# EAGLE design Main board v2.0 (EAGLE 7.5.0)
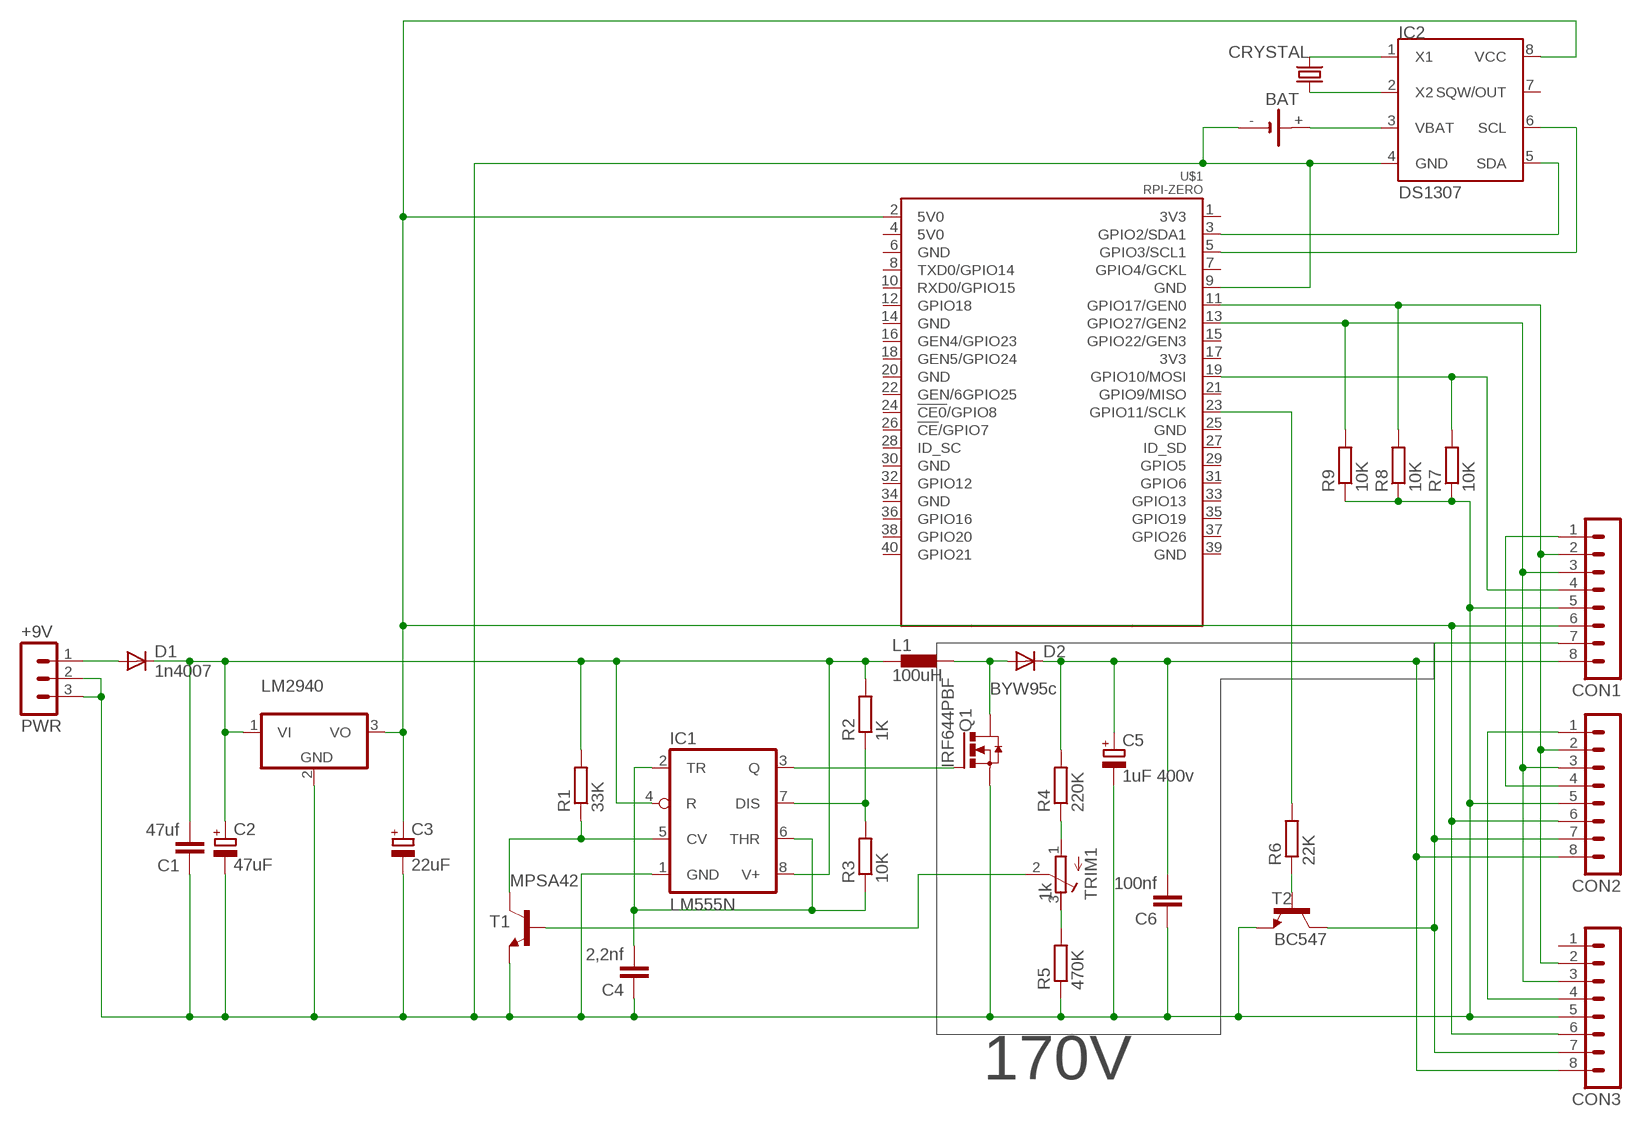
[diagram p0: schematic, sheet 1]

## Parts
BAT  CH291-1220LF  [CH291-1220LF]
C1  47uf  C-EU025-025X050  [C025-025X050]
C2  47uF  CPOL-EUE5-8.5  [E5-8,5]
C3  22uF  CPOL-EUE2.5-5V  [E2,5-4R]
C4  2,2nf  C5/2.5  [C5B2.5]
C5  1uF 400v  CPOL-EUE2.5-6  [E2,5-6]
C6  100nf  C-EU075-032X103  [C075-032X103]
CON1  MA08-1  [MA08-1]
CON2  MA08-1  [MA08-1]
CON3  MA08-1  [MA08-1]
CRYSTAL  crystal  CRYSTALTC26H  [TC26H]
D1  1n4007  DIODE-DO41-10  [DO41-10]
D2  BYW95c  BYW95  [SOD64-10]
IC1  LM555N  [DIL08]
IC2  DS1307  [SOIC-8]
L1  100uH  DR1030  [DR1030]
LM2940  7824T  7824TV  [TO220V]
PWR  +9V  MA03-1  [MA03-1]
Q1  IRF644PBF  IRF3704L  [TO262-H]
R1  33K  R-EU_0207/10  [0207/10]
R2  1K  R-EU_0207/10  [0207/10]
R3  10K  R-EU_0207/10  [0207/10]
R4  220K  R-EU_0207/10  [0207/10]
R5  470K  R-EU_0207/10  [0207/10]
R6  22K  R-EU_0207/10  [0207/10]
R7  10K  R-EU_0207/10  [0207/10]
R8  10K  R-EU_0207/10  [0207/10]
R9  10K  R-EU_0207/10  [0207/10]
T1  MPSA42  MPSA42-NPN-TO92-EBC  [TO92-EBC]
T2  BC547  MPSL51-NPN-TO92-CBE  [TO92-CBE]
TRIM1  1k  R-TRIMM64W  [RTRIM64W]
U$1  RPI-ZERO  [RASPBERRYPI_BASTELSTUBE_V13_RASPI_BOARD_B+_FULL]

## Nets
5V0: C3.+ CON1.6 CON2.6 CON3.6 IC2.8(VCC) LM2940.3(VO) U$1.2(5V0)
170V: C5.+ C6.2 CON1.8 CON2.8 CON3.8 D2.C R4.2
CLK: CON1.2 CON2.2 CON3.2 R8.2 U$1.11(GPIO17/GEN0)
DATA: CON1.4 R7.2 U$1.19(GPIO10/MOSI)
GND@1: BAT.- C1.1 C2.- C3.- C4.1 C5.- C6.1 CON1.5 CON2.5 CON3.5 IC1.1(GND) IC2.4(GND) LM2940.2(GND) PWR.2 PWR.3 Q1.3(S) R5.1 R7.1 R8.1 R9.1 T1.E T2.E U$1.9(GND)
LATCH: CON1.3 CON2.3 CON3.3 R9.2 U$1.13(GPIO27/GEN2)
LED: CON1.7 CON2.7 CON3.7 T2.C
LEDDRIVER: R6.2 U$1.23(GPIO11/SCLK)
N$1: CON1.1 CON2.4
N$2: CON2.1 CON3.4
N$7: R4.1 TRIM1.1(A)
N$9: R6.1 T2.B
N$11: IC2.6(SCL) U$1.5(GPIO3/SCL1)
N$12: IC2.5(SDA) U$1.3(GPIO2/SDA1)
N$14: CRYSTAL.1 IC2.2(X2)
N$15: CRYSTAL.2 IC2.1(X1)
N$95: D1.A PWR.1
N$99: IC1.3(Q) Q1.1(G)
N$100: IC1.7(DIS) R2.1 R3.2
N$101: IC1.5(CV) R1.1 T1.C
N$102: C4.2 IC1.2(TR) IC1.6(THR) R3.1
N$103: D2.A L1.2 Q1.2(D)
N$106: T1.B TRIM1.2(S)
N$107: R5.2 TRIM1.3(E)
V+: C1.2 C2.+ D1.C IC1.4(R) IC1.8(V+) L1.1 LM2940.1(VI) R1.2 R2.2
VBAT: BAT.+ IC2.3(VBAT)
Unconnected: CON3.1 IC2.7(SQW/OUT) U$1.1(3V3) U$1.4(5V0) U$1.6(GND) U$1.7(GPIO4/GCKL) U$1.8(TXD0/GPIO14) U$1.10(RXD0/GPIO15) U$1.12(GPIO18) U$1.14(GND) U$1.15(GPIO22/GEN3) U$1.16(GEN4/GPIO23) U$1.17(3V3) U$1.18(GEN5/GPIO24) U$1.20(GND) U$1.21(GPIO9/MISO) U$1.22(GEN/6GPIO25) U$1.24(!CE0!/GPIO8) U$1.25(GND) U$1.26(!CE!/GPIO7) U$1.27(ID_SD) U$1.28(ID_SC) U$1.29(GPIO5) U$1.30(GND) U$1.31(GPIO6) U$1.32(GPIO12) U$1.33(GPIO13) U$1.34(GND) U$1.35(GPIO19) U$1.36(GPIO16) U$1.37(GPIO26) U$1.38(GPIO20) U$1.39(GND) U$1.40(GPIO21)

## Library data of the parts
BAT = battery:CH291-1220LF: Battery Holder, SMT, 12mm multicomp PART NO. CH291-1220LF Source: Data sheet <http://www.farnell.com/datasheets/1505860.pdf>
C1 C6 = rcl:C-EU: CAPACITOR, European symbol
C2 C3 C5 = rcl:CPOL-EU: POLARIZED CAPACITOR, European symbol
C4 = capacitor-wima:C: CAPACITOR naming: grid - package width
CON1-CON3 = con-lstb:MA08-1: PIN HEADER; OC_FARNELL: unknown; OC_NEWARK: unknown
CRYSTAL = crystal:CRYSTAL: CRYSTAL; OC_FARNELL: unknown; OC_NEWARK: unknown
D1 = diode:DIODE-: DIODE
D2 = diode:BYW95: DIODE fast soft-recovery rectifier
IC1 = linear:*555: TIMER
IC2 = dallas-1:DS1307: I2C Serial RTC w/56 bytes battery backed RAM
L1 = inductors:DR1030: DR1030 Series Low Profile Power Inductors Source: Data sheet <http://www.cooperbussmann.com/pdf/c73e479f-f867-4c64-ae26-9c1f23814163.pdf>
LM2940 = linear:78*: Positive VOLTAGE REGULATOR Source: http://cache.national.com/ds/LM/LM78L05.pdf http://www.fairchildsemi.com/ds/LM/LM7805.pdf
PWR = con-lstb:MA03-1: PIN HEADER; OC_FARNELL: unknown; OC_NEWARK: unknown
Q1 = transistor-power:IRF3704: SMPS MOSFET HEXFET® Power MOSFET Source: http://www.irf.com/product-info/datasheets/data/irf3704.pdf
R1-R9 = resistor:R-EU_: RESISTOR, European symbol
T1 T2 = transistor:*-NPN-: NPN Transistror BF959 corrected 2008.03.06
TRIM1 = rcl:R-TRIMM: Trimm resistor
U$1 = RPI-Zero:RPI-ZERO

## Board
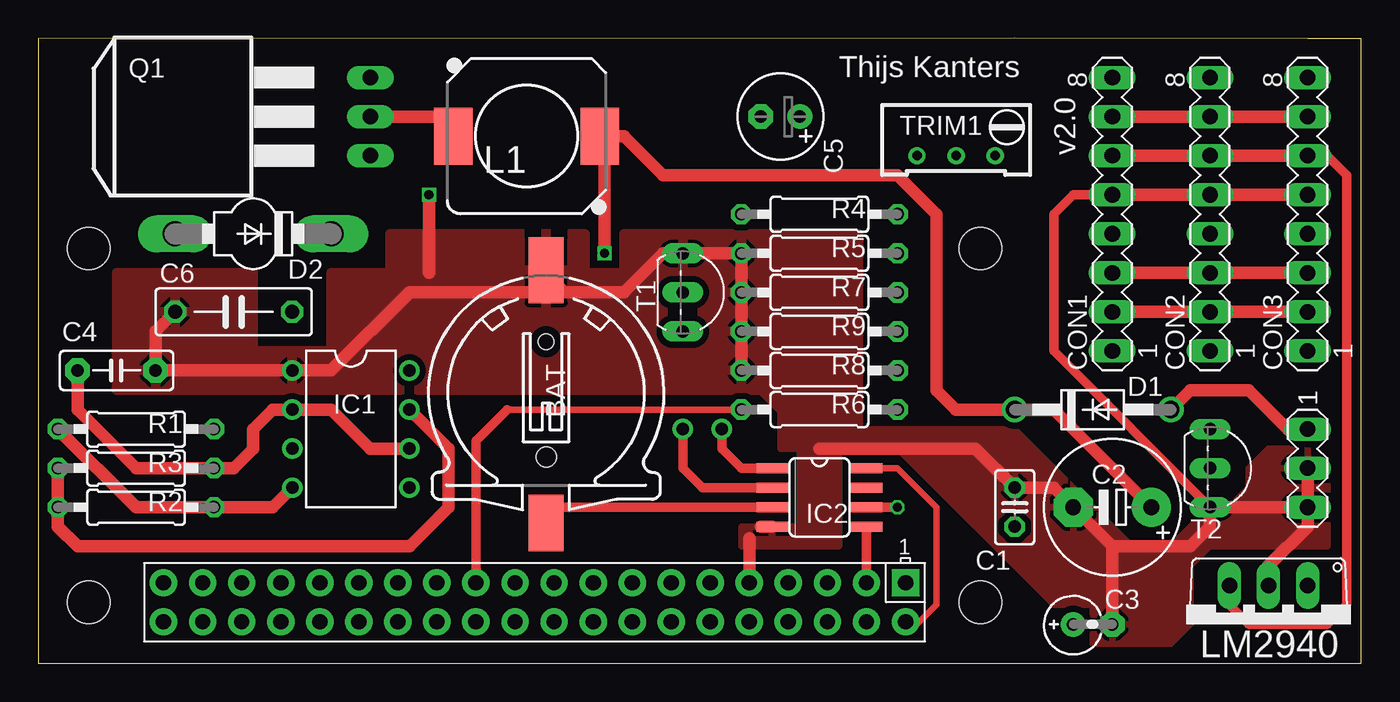
[diagram p1: board, top side]
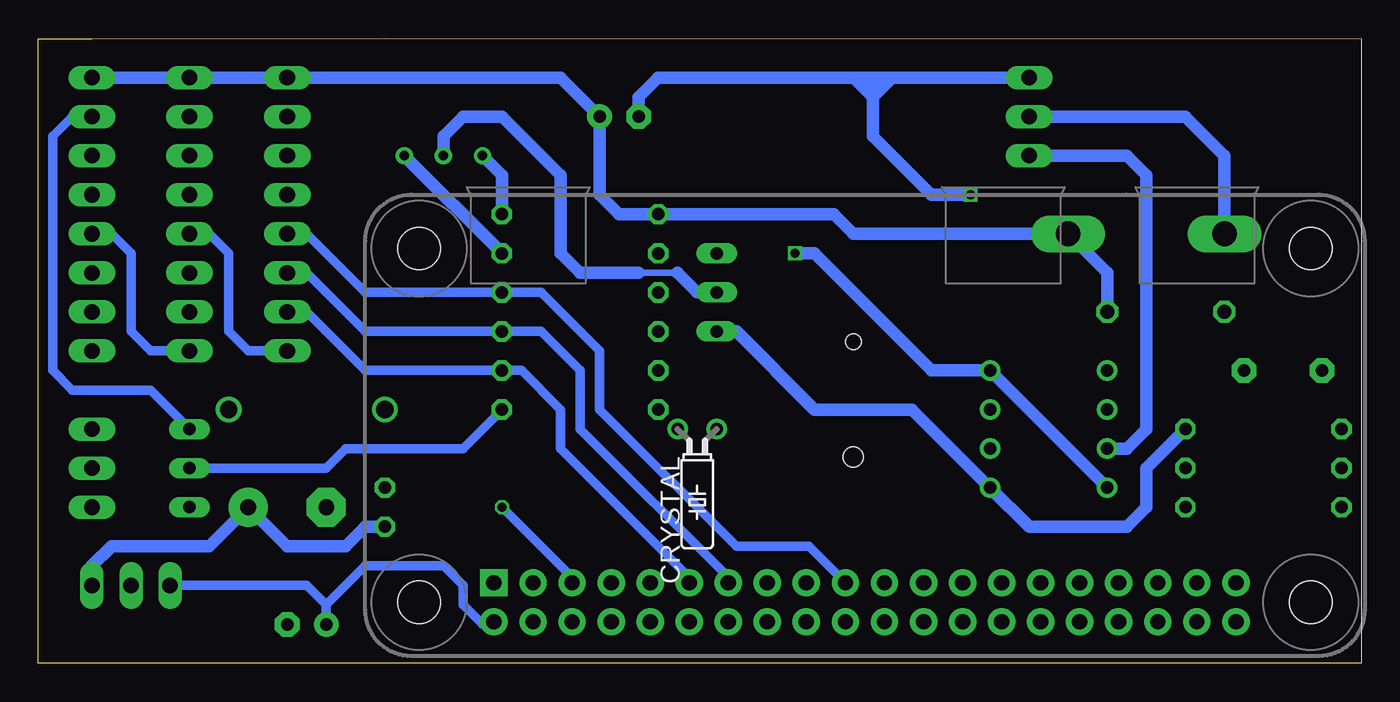
[diagram p2: board, bottom side, seen from below]

Size 86.03 x 40.64 mm. Coordinates in mm from the lower left corner, seen from the top.
Outline: 0,0 86.03,0 86.03,40.63 82.55,40.63 63.5,40.64 0,40.63 0,0
Copper layers (1*16): Top 0.035mm / dielectric 1.5mm / Bottom 0.035mm
Design rules "ShenZhen2U EagleRules *": minimum track width 16mil, minimum drill 12mil, track to track 16mil, track to pad 14mil, pad to pad 14mil, via to via 14mil, smd to smd 0mil, copper to edge 20mil, drill to drill 10mil, minimum pad ring 10mil, minimum via ring 6mil, stop-mask expansion 2mil, vias tented up to drill 25mil, thermal gap 10mil

### Footprints (pad centres in the part's own frame; a part is rotated, then mirrored left to right if it is on the bottom)
CH291-1220LF = smd 2.3 x 3.66: + 0,-2.296 | smd 2.3 x 4.3: - 0,14.146 | hole 1.3: 0,2 | hole 1: 0,9.5
C025-025X050 = drill 0.813 octagon: 1 -1.27,0; 2 1.27,0
E5-8,5 = drill 1.016 pad 2.54: + -2.54,0 | drill 1.016 pad 2.54 octagon: - 2.54,0
E2,5-4R = drill 0.813 pad 1.6: + -1.27,0 | drill 0.813 pad 1.6 octagon: - 1.27,0
C5B2.5 = drill 0.813 pad 1.6 octagon: 1 -2.54,0; 2 2.54,0
E2,5-6 = drill 0.813 pad 1.6: + -1.27,0 | drill 0.813 pad 1.6 octagon: - 1.27,0
C075-032X103 = drill 0.914 octagon: 1 -3.81,0; 2 3.81,0
MA08-1 = drill 1.016 long: 1 -8.89,0; 2 -6.35,0; 3 -3.81,0; 4 -1.27,0; 5 1.27,0; 6 3.81,0; 7 6.35,0; 8 8.89,0
TC26H = drill 0.813: 1 -1.27,0; 2 1.27,0
DO41-10 = drill 1.118: A 5.08,0; C -5.08,0
SOD64-10 = drill 1.6 long: A 5.08,0; C -5.08,0
DIL08 = drill 0.813 pad 1.27: 1 -3.81,-3.81; 2 -1.27,-3.81; 3 1.27,-3.81; 4 3.81,-3.81; 5 3.81,3.81; 6 1.27,3.81; 7 -1.27,3.81; 8 -3.81,3.81
SOIC-8 = smd 2.032 x 0.66: 1 -3.073,1.27; 2 -3.073,0; 3 -3.073,-1.27; 4 -3.073,-2.54; 5 3.073,-2.54; 6 3.073,-1.27; 7 3.073,0; 8 3.073,1.27
DR1030 = smd 3.7 x 2.5: 1 0,4.75; 2 0,-4.75
TO220V = drill 1.016 long: 1 -2.54,-2.54; 2 0,-2.54; 3 2.54,-2.54
MA03-1 = drill 1.016 long: 1 -2.54,0; 2 0,0; 3 2.54,0
TO262-H = drill 1.016 long: 1 -2.54,-12.7; 2 0,-12.7; 3 2.54,-12.7
0207/10 = drill 0.813 octagon: 1 -5.08,0; 2 5.08,0
TO92-EBC = drill 0.813 long: B 0,-1.27; C 2.54,-1.27; E -2.54,-1.27
TO92-CBE = drill 0.813 long: B 0,0; C -2.54,0; E 2.54,0
RTRIM64W = drill 0.61: 1 1.27,-2.54; 2 1.27,0; 3 1.27,2.54
RASPBERRYPI_BASTELSTUBE_V13_RASPI_BOARD_B+_FULL = drill 1 pad 1.778 square: 1 8.37,25.23 | drill 1 pad 1.778: 2 8.37,27.77; 3 10.91,25.23; 4 10.91,27.77; 5 13.45,25.23; 6 13.45,27.77; 7 15.99,25.23; 8 15.99,27.77; 9 18.53,25.23; 10 18.53,27.77; 11 21.07,25.23; 12 21.07,27.77; 13 23.61,25.23; 14 23.61,27.77; 15 26.15,25.23; 16 26.15,27.77; 17 28.69,25.23; 18 28.69,27.77; 19 31.23,25.23; 20 31.23,27.77; 21 33.77,25.23; 22 33.77,27.77; 23 36.31,25.23; 24 36.31,27.77; 25 38.85,25.23; 26 38.85,27.77; 27 41.39,25.23; 28 41.39,27.77; 29 43.93,25.23; 30 43.93,27.77; 31 46.47,25.23; 32 46.47,27.77; 33 49.01,25.23; 34 49.01,27.77; 35 51.55,25.23; 36 51.55,27.77; 37 54.09,25.23; 38 54.09,27.77; 39 56.63,25.23; 40 56.63,27.77 | hole 2.75: 3.5,3.5; 3.5,26.5; 61.5,3.5; 61.5,26.5

### Placement (x,y rotation side)
BAT  33.02,11.43 0 top
C1  63.5,10.16 270 top
C2  69.85,10.16 180 top
C3  68.58,2.54 0 top
C4  5.08,19.05 180 top
C5  48.26,35.56 180 top
C6  12.7,22.86 0 top
CON1  69.85,29.21 90 top
CON2  76.2,29.21 90 top
CON3  82.55,29.21 90 top
CRYSTAL  43.18,15.24 180 bottom
D1  68.58,16.51 0 top
D2  13.97,27.94 180 top
IC1  20.32,15.24 270 top
IC2  50.8,11.43 0 top
L1  31.75,34.29 270 top
LM2940  80.01,2.54 180 top
PWR  82.55,12.7 270 top
Q1  8.89,35.56 90 top
R1  6.35,15.24 180 top
R2  6.35,10.16 0 top
R3  6.35,12.7 180 top
R4  50.8,29.21 180 top
R5  50.8,26.67 0 top
R6  50.8,16.51 180 top
R7  50.8,24.13 0 top
R8  50.8,19.05 0 top
R9  50.8,21.59 0 top
T1  43.18,24.13 270 top
T2  76.2,12.7 270 top
TRIM1  59.69,34.29 270 top
U$1  64.77,30.48 180 top

### Tracks (layer width: path | path; a pad name or v marks a point on that pad's centre or on a via)
5V0
  Top 0.406: IC2.8 55.88,12.7 58.42,10.16 58.42,3.81 57.15,2.54 56.57,2.54 U$1.2
  Top 0.61: CON3.6 83.82,33.02 85.09,31.75 85.09,3.81 83.82,2.54 78.74,2.54 77.47,3.81 LM2940.3
  Top 0.813: CON3.6 CON2.6 CON1.6
  Bottom 0.61: C3.+ 67.31,3.81 | U$1.2 56.57,2.54 57.15,2.54 58.42,3.81 58.42,5.08 59.69,6.35 64.77,6.35 67.31,3.81 | 67.31,3.81 68.58,5.08 LM2940.3
170V
  Bottom 0.813: C6.2 16.51,25.4 D2.C 33.02,27.94 34.29,29.21 R4.2 48.26,29.21 49.53,30.48 C5.+ 52.07,38.1 CON1.8 CON2.8 CON3.8
CLK
  Top 0.813: CON1.2 CON2.2 CON3.2
  Bottom 0.61: CON1.2 68.58,22.86 64.77,19.05 R8.2 54.61,19.05 52.07,16.51 52.07,13.97 43.7,5.6 U$1.11
DATA
  Bottom 0.61: CON1.4 68.58,27.94 64.77,24.13 R7.2 53.34,24.13 49.53,20.32 49.53,16.51 40.64,7.62 35.91,7.62 U$1.19
GND@1  (via drill 0.6)
  Top 0.406: R8.1 45.87,21.89 45.72,21.89
  Top 0.61: 34.29,24.13 BAT.- | CON1.5 67.31,30.48 66.04,29.21 66.04,20.32 T2.E
  Top 0.813: U$1.9 46.24,8.14 | 46.99,8.89 IC2.4 | R9.1 45.72,21.89 | R9.1 R8.1 R7.1 | 50.8,13.97 60.96,13.97 C1.1 66.04,11.43 C2.- 69.85,7.62 | R7.1 R5.1 T1.E 40.64,26.67 38.1,24.13 34.29,24.13 24.13,24.13 19.05,19.05 IC1.1 C4.1 7.62,21.59 C6.1 | R7.1 R9.1 | 69.85,7.62 C3.- | PWR.2 PWR.3 | PWR.3 T2.E 76.2,8.89 74.93,7.62 69.85,7.62 | PWR.3 82.55,8.89 80.01,6.35 LM2940.2 | CON1.5 CON2.5 CON3.5 | v25.4,30.48 25.4,25.4
  Bottom 0.813: Q1.3 30.48,38.1 | 31.75,38.1 33.02,38.1 | C5.- 46.99,36.83 45.72,38.1 33.02,38.1 | 33.02,38.1 31.75,36.83 | 31.75,36.83 30.48,38.1 | 30.48,38.1 31.75,38.1 | 31.75,38.1 31.75,36.83 | 31.75,36.83 31.75,34.29 27.94,30.48 v25.4,30.48
  pour Top: 49.53,15.24 49.53,8.89 45.72,8.89 45.72,7.62 52.07,7.62 52.07,15.24
  pour Top: 5.08,25.4 13.97,25.4 13.97,20.32 19.05,20.32 19.05,25.4 22.86,25.4 22.86,27.94 35.56,27.94 35.56,25.4 38.1,25.4 38.1,27.94 53.34,27.94 53.34,15.24 49.53,15.24 46.99,17.78 5.08,17.78
  pour Top: 48.26,16.51 48.26,13.97 55.88,13.97 66.04,3.81 68.58,3.81 68.58,1.27 73.66,1.27 74.93,2.54 74.93,6.35 76.2,7.62 83.82,7.62 83.82,13.97 80.01,13.97 78.74,12.7 78.74,11.43 77.47,10.16 76.2,10.16 73.66,7.62 71.12,7.62 63.5,15.24 53.34,15.24 53.34,16.51
LATCH
  Top 0.813: CON1.3 CON2.3 CON3.3
  Bottom 0.61: CON1.3 68.58,25.4 64.77,21.59 R9.2 53.34,21.59 50.8,19.05 50.8,15.24 41.16,5.6 U$1.13
LED
  Top 0.813: CON1.7 CON2.7 CON3.7
  Bottom 0.61: CON3.7 83.82,35.56 85.09,34.29 85.09,19.05 83.82,17.78 78.74,17.78 T2.C
LEDDRIVER
  Top 0.406: R6.2 30.48,16.51
  Top 0.61: U$1.23 28.46,14.49 30.48,16.51
N$1
  Bottom 0.61: CON1.1 72.39,20.32 73.66,21.59 73.66,26.67 74.93,27.94 CON2.4
N$2
  Bottom 0.61: CON3.4 81.28,27.94 80.01,26.67 80.01,21.59 78.74,20.32 CON2.1
N$7
  Bottom 0.813: TRIM1.1 55.88,31.75 R4.1
N$9
  Bottom 0.61: T2.B 67.31,12.7 66.04,13.97 58.42,13.97 R6.1
N$11  (via drill 0.6)
  Top 0.61: v55.88,10.16 IC2.6
  Bottom 0.61: U$1.5 51.32,5.6 v55.88,10.16
N$12
  Top 0.61: U$1.3 53.86,8.88 IC2.5
N$14
  Top 0.61: CRYSTAL.1 41.91,12.7 43.18,11.43 IC2.2
N$15
  Top 0.61: CRYSTAL.2 44.45,13.97 45.72,12.7 IC2.1
N$95
  Top 0.813: PWR.1 81.28,15.24 78.74,17.78 74.93,17.78 D1.A
N$99
  Bottom 0.813: IC1.3 15.24,13.97 13.97,15.24 13.97,31.75 15.24,33.02 Q1.1
N$100
  Top 0.813: IC1.7 26.67,13.97 26.67,10.16 24.13,7.62 2.54,7.62 1.27,8.89 R2.1 R3.2
N$101
  Bottom 0.813: R1.1 13.97,12.7 13.97,10.16 15.24,8.89 21.59,8.89 IC1.5 29.21,16.51 35.56,16.51 40.64,21.59 T1.C
N$102
  Top 0.813: IC1.6 21.59,13.97 19.05,16.51 IC1.2 15.24,16.51 13.97,15.24 13.97,13.97 12.7,12.7 R3.1 6.35,12.7 2.54,16.51 C4.2
N$103
  Top 0.813: Q1.2 27.3,35.56 L1.2
  Bottom 0.813: D2.A 8.89,33.02 11.43,35.56 Q1.2
N$106
  Bottom 0.406: 46.99,25.4 44.45,25.4
  Bottom 0.813: TRIM1.2 59.69,34.29 58.42,35.56 55.88,35.56 52.07,31.75 52.07,26.67 50.8,25.4 46.99,25.4 | T1.B 43.18,24.13 44.45,25.4
N$107
  Bottom 0.813: TRIM1.3 R5.2
V+  (via drill 0.6)
  Top 0.813: IC1.4 15.24,10.16 R2.2 6.35,10.16 R1.2 | C2.+ 66.04,16.51 D1.C 59.69,16.51 58.42,17.78 58.42,29.21 55.88,31.75 40.64,31.75 38.1,34.29 36.83,34.29 | 36.83,34.29 L1.1 | v36.83,26.67 36.83,34.29
  Bottom 0.813: IC1.4 IC1.8 27.94,19.05 35.56,26.67 v36.83,26.67 | LM2940.1 82.55,6.35 81.28,7.62 74.93,7.62 C2.+ 69.85,7.62 66.04,7.62 64.77,8.89 C1.2
VBAT
  Top 0.61: BAT.+ 33.02,10.16 IC2.3

### Text on the board
tNames: Thijs Kanters | v2.0